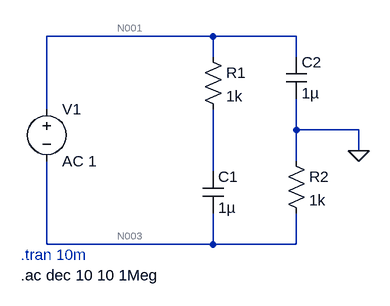
[diagram p0: schematic F_AC.asc]
F_AC.asc, the LTspice schematic file:
Version 4
SHEET 1 880 680
WIRE 352 16 96 16
WIRE 480 16 352 16
WIRE 352 48 352 16
WIRE 480 48 480 16
WIRE 96 128 96 16
WIRE 480 160 480 112
WIRE 576 160 480 160
WIRE 576 192 576 160
WIRE 480 208 480 160
WIRE 352 224 352 128
WIRE 96 336 96 208
WIRE 352 336 352 288
WIRE 352 336 96 336
WIRE 480 336 480 288
WIRE 480 336 352 336
FLAG 576 192 0
SYMBOL voltage 96 112 R0
WINDOW 123 0 0 Left 0
WINDOW 39 0 0 Left 0
SYMATTR InstName V1
SYMATTR Value AC 1
SYMBOL res 336 32 R0
SYMATTR InstName R1
SYMATTR Value 1k
SYMBOL cap 336 224 R0
SYMATTR InstName C1
SYMATTR Value 1µ
SYMBOL cap 464 48 R0
SYMATTR InstName C2
SYMATTR Value 1µ
SYMBOL res 464 192 R0
SYMATTR InstName R2
SYMATTR Value 1k
TEXT 56 352 Left 2 ;.tran 10m
TEXT 56 384 Left 2 !.ac dec 10 10 1Meg

The netlist it stands for:
* F_AC.asc
V1 N001 N003 AC 1
R1 N001 N002 1k
C1 N002 N003 1µ
C2 N001 0 1µ
R2 0 N003 1k
* .tran 10m
.ac dec 10 10 1Meg
.backanno
.end

* Results of the author's LTspice run, read from the files saved beside the schematic
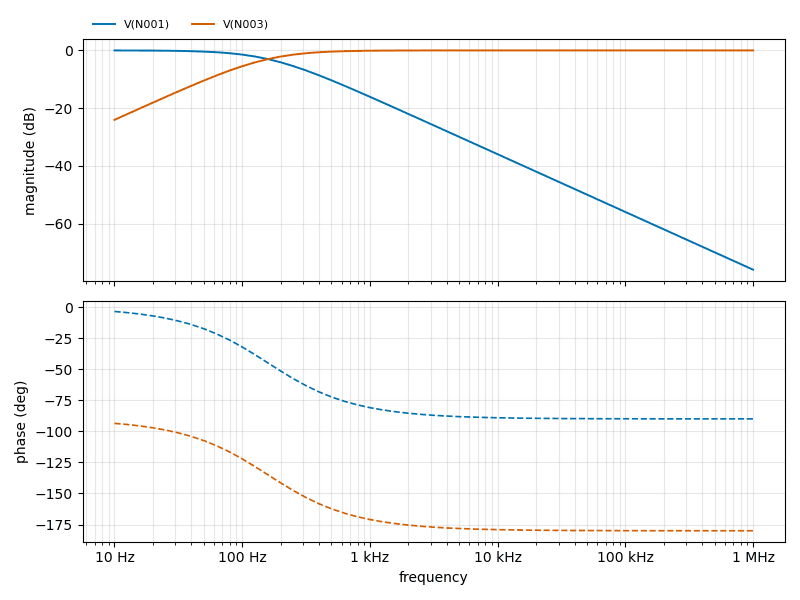
[diagram p1: AC Analysis of F_AC.asc, plotted from the saved traces]
* AC Analysis, 1 run:
*   V(N001): -0.02 dB at 10 Hz, -75.96 dB at 1 MHz, peak -0.02 dB at 10 Hz, 3 dB below the peak at 159.7 Hz
*   V(N003): -24.05 dB at 10 Hz, -0.00 dB at 1 MHz, peak -0.00 dB at 1 MHz, 3 dB below the peak at 159.2 Hz